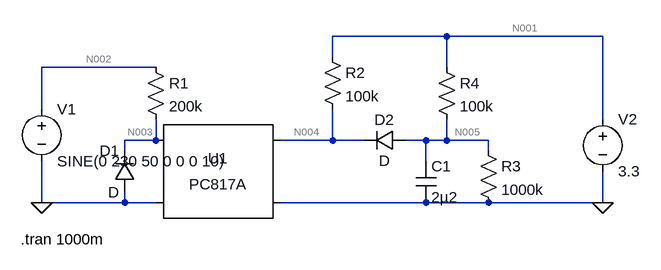
[diagram p0: schematic ZeroDetect.asc]
ZeroDetect.asc, the LTspice schematic file:
Version 4
SHEET 1 1008 680
WIRE 704 0 528 0
WIRE 944 0 704 0
WIRE 528 32 528 0
WIRE 256 48 80 48
WIRE 704 48 704 0
WIRE 80 112 80 48
WIRE 944 128 944 0
WIRE 256 160 256 128
WIRE 256 160 208 160
WIRE 528 160 528 112
WIRE 528 160 448 160
WIRE 576 160 528 160
WIRE 672 160 640 160
WIRE 704 160 704 128
WIRE 704 160 672 160
WIRE 768 160 704 160
WIRE 208 176 208 160
WIRE 768 176 768 160
WIRE 672 192 672 160
WIRE 80 256 80 192
WIRE 208 256 208 240
WIRE 208 256 80 256
WIRE 256 256 208 256
WIRE 672 256 448 256
WIRE 768 256 672 256
WIRE 944 256 944 208
WIRE 944 256 768 256
FLAG 944 256 0
FLAG 80 256 0
SYMBOL voltage 80 96 R0
WINDOW 123 0 0 Left 0
WINDOW 39 0 0 Left 0
SYMATTR InstName V1
SYMATTR Value SINE(0 230 50 0 0 0 10)
SYMBOL res 240 32 R0
SYMATTR InstName R1
SYMATTR Value 200k
SYMBOL Optos\\PC817A 352 208 R0
SYMATTR InstName U1
SYMBOL voltage 944 112 R0
WINDOW 123 0 0 Left 0
WINDOW 39 0 0 Left 0
SYMATTR InstName V2
SYMATTR Value 3.3
SYMBOL res 512 16 R0
SYMATTR InstName R2
SYMATTR Value 100k
SYMBOL diode 224 240 R180
WINDOW 0 24 64 Left 2
WINDOW 3 24 0 Left 2
SYMATTR InstName D1
SYMBOL cap 656 192 R0
SYMATTR InstName C1
SYMATTR Value 2µ2
SYMBOL res 752 160 R0
SYMATTR InstName R3
SYMATTR Value 1000k
SYMBOL diode 640 144 R90
WINDOW 0 0 32 VBottom 2
WINDOW 3 32 32 VTop 2
SYMATTR InstName D2
SYMBOL res 688 32 R0
SYMATTR InstName R4
SYMATTR Value 100k
TEXT 48 312 Left 2 !.tran 1000m

The netlist it stands for:
* ZeroDetect.asc
V1 N002 0 SINE(0 230 50 0 0 0 10)
R1 N002 N003 200k
XU1 N003 0 N004 0 PC817 Igain=1m
V2 N001 0 3.3
R2 N001 N004 100k
D1 0 N003 D
C1 N005 0 2µ2
R3 N005 0 1000k
D2 N005 N004 D
R4 N001 N005 100k
.model D D
.lib standard.dio
.tran 1000m
.lib PC817.sub
.backanno
.end

* Results of the author's LTspice run, read from the files saved beside the schematic
* Operating Point, zero values left out:
*   V(n004) = 3.3 V
*   V(n001) = 3.3 V
*   V(n005) = 3 V
*   I(R2) = 9.514 pA
*   I(R3) = 3 µA
*   I(R4) = 3 µA
*   I(V2) = -3 µA
*   Ix(u1:3) = 9.203 pA
*   Ix(u1:4) = -5.903 pA
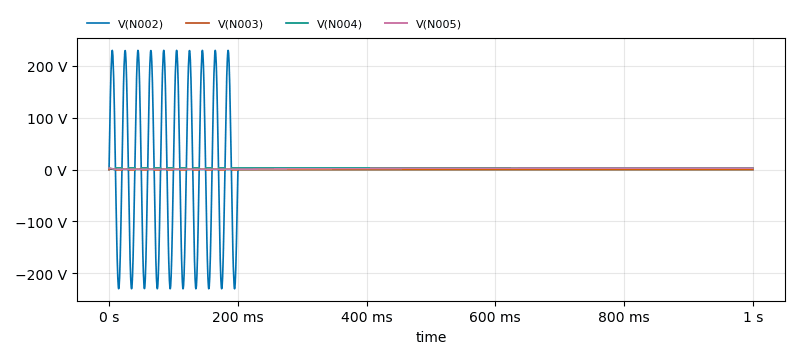
[diagram p1: Transient Analysis of ZeroDetect.asc, plotted from the saved traces]
* Transient Analysis, 1 run:
*   V(N002): min -229.9 V, max 230 V, average -2.294 mV, rms 72.7 V, last 0 V
*   V(N003): min -658.6 mV, max 1.018 V, average 35.96 mV, rms 374.4 mV, last 0 V
*   V(N004): min 94.35 mV, max 3.3 V, average 2.998 V, rms 3.135 V, last 3.3 V
*   V(N005): min 660.4 mV, max 3 V, average 2.115 V, rms 2.283 V, last 2.959 V